# Altium schematic sheet STM32Fx.SchDoc
size A4; DocumentNumber: 3; Revision: C.1(PCB.SCH); SheetNumber: 3; SheetTotal: 4
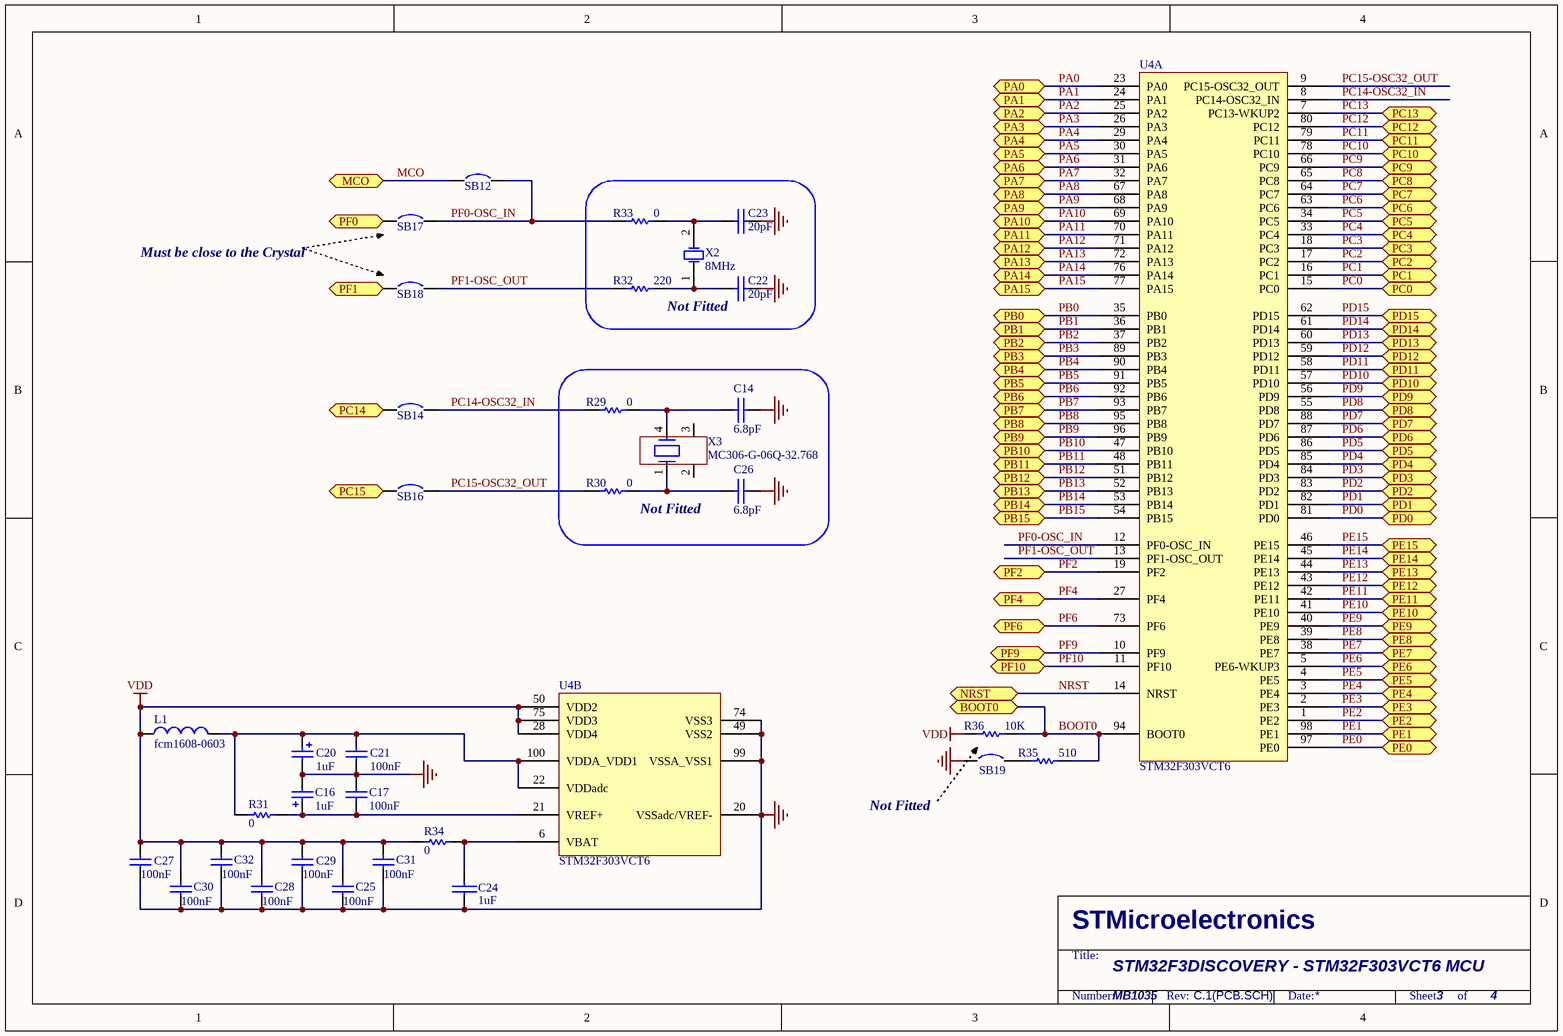
[diagram p0: STM32Fx.SchDoc]

## Parts
C14  6.8pF  [0603C]
C16  1uF  [CASE-AA]
C17  100nF  [0603C]
C20  1uF  [CASE-AA]
C21  100nF  [0603C]
C22  20pF  [0603C]
C23  20pF  [0603C]
C24  1uF  [0603C]
C25  100nF  [0603C]
C26  6.8pF  [0603C]
C27  100nF  [0603C]
C28  100nF  [0603C]
C29  100nF  [0603C]
C30  100nF  [0603C]
C31  100nF  [0603C]
C32  100nF  [0603C]
L1  fcm1608-0603  [0603L]
R29  0  [0402R]
R30  0  [0402R]
R31  0  [0402R]
R32  220  [0402R]
R33  0  [0402R]
R34  0  [0402R]
R35  510  [0402R]
R36  10K  [0402R]
SB12  Circuit Breaker  [JP2_SMD]  (value not drawn)
SB14  Circuit Breaker  [JP2_SMD]  (value not drawn)
SB16  Circuit Breaker  [JP2_SMD]  (value not drawn)
SB17  Circuit Breaker  [JP2_SMD]  (value not drawn)
SB18  Circuit Breaker  [JP2_SMD]  (value not drawn)
SB19  Circuit Breaker  [JP2_SMD]  (value not drawn)
U4  STM32F303VCT6  [LQFP100]  (parts A,B of 2)
X2  8MHz  [XTAL1]
X3  MC306-G-06Q-32.768  [MC306-CRYSTAL]

## Blocks framed on the sheet
Not Fitted: C22 C23 R32 R33 X2
Not Fitted: C14 C26 R29 R30 X3

## Ports
BOOT0, MCO, NRST, PA0, PA1, PA2, PA3, PA4, PA5, PA6, PA7, PA8, PA9, PA10, PA11, PA12, PA13, PA14, PA15, PB0, PB1, PB2, PB3, PB4, PB5, PB6, PB7, PB8, PB9, PB10, PB11, PB12, PB13, PB14, PB15, PC0, PC1, PC2, PC3, PC4, PC5, PC6, PC7, PC8, PC9, PC10, PC11, PC12, PC13, PC14, PC15, PD0, PD1, PD2, PD3, PD4, PD5, PD6, PD7, PD8, PD9, PD10, PD11, PD12, PD13, PD14, PD15, PE0, PE1, PE2, PE3, PE4, PE5, PE6, PE7, PE8, PE9, PE10, PE11, PE12, PE13, PE14, PE15, PF0, PF1, PF2, PF4, PF6, PF9, PF10

## Nets
GND: C14.2 C16.2 C17.1 C20.2 C21.1 C22.1 C23.1 C24.2 C25.1 C26.2 C27.1 C28.1 C29.1 C30.1 C31.2 C32.2 SB19.1 U4.20(VSSadc/VREF-) U4.49(VSS2) U4.74(VSS3) U4.99(VSSA_VSS1)
VDD: C25.2 C27.2 C28.2 C29.2 C30.2 C31.1 C32.1 L1.1 R34.2 R36.1 U4.28(VDD4) U4.50(VDD2) U4.75(VDD3)
BOOT0: R35.2 R36.2 U4.94(BOOT0) ; port BOOT0
MCO: SB12.1 ; port MCO
NRST: U4.14(NRST) ; port NRST
PA0: U4.23(PA0) ; port PA0
PA1: U4.24(PA1) ; port PA1
PA2: U4.25(PA2) ; port PA2
PA3: U4.26(PA3) ; port PA3
PA4: U4.29(PA4) ; port PA4
PA5: U4.30(PA5) ; port PA5
PA6: U4.31(PA6) ; port PA6
PA7: U4.32(PA7) ; port PA7
PA8: U4.67(PA8) ; port PA8
PA9: U4.68(PA9) ; port PA9
PA10: U4.69(PA10) ; port PA10
PA11: U4.70(PA11) ; port PA11
PA12: U4.71(PA12) ; port PA12
PA13: U4.72(PA13) ; port PA13
PA14: U4.76(PA14) ; port PA14
PA15: U4.77(PA15) ; port PA15
PB0: U4.35(PB0) ; port PB0
PB1: U4.36(PB1) ; port PB1
PB2: U4.37(PB2) ; port PB2
PB3: U4.89(PB3) ; port PB3
PB4: U4.90(PB4) ; port PB4
PB5: U4.91(PB5) ; port PB5
PB6: U4.92(PB6) ; port PB6
PB7: U4.93(PB7) ; port PB7
PB8: U4.95(PB8) ; port PB8
PB9: U4.96(PB9) ; port PB9
PB10: U4.47(PB10) ; port PB10
PB11: U4.48(PB11) ; port PB11
PB12: U4.51(PB12) ; port PB12
PB13: U4.52(PB13) ; port PB13
PB14: U4.53(PB14) ; port PB14
PB15: U4.54(PB15) ; port PB15
PC0: U4.15(PC0) ; port PC0
PC1: U4.16(PC1) ; port PC1
PC2: U4.17(PC2) ; port PC2
PC3: U4.18(PC3) ; port PC3
PC4: U4.33(PC4) ; port PC4
PC5: U4.34(PC5) ; port PC5
PC6: U4.63(PC6) ; port PC6
PC7: U4.64(PC7) ; port PC7
PC8: U4.65(PC8) ; port PC8
PC9: U4.66(PC9) ; port PC9
PC10: U4.78(PC10) ; port PC10
PC11: U4.79(PC11) ; port PC11
PC12: U4.80(PC12) ; port PC12
PC13: U4.7(PC13-WKUP2) ; port PC13
PC14: SB14.1 ; port PC14
PC14-OSC32_IN: R29.1 SB14.2 U4.8(PC14-OSC32_IN)
PC15: SB16.1 ; port PC15
PC15-OSC32_OUT: R30.1 SB16.2 U4.9(PC15-OSC32_OUT)
PD0: U4.81(PD0) ; port PD0
PD1: U4.82(PD1) ; port PD1
PD2: U4.83(PD2) ; port PD2
PD3: U4.84(PD3) ; port PD3
PD4: U4.85(PD4) ; port PD4
PD5: U4.86(PD5) ; port PD5
PD6: U4.87(PD6) ; port PD6
PD7: U4.88(PD7) ; port PD7
PD8: U4.55(PD8) ; port PD8
PD9: U4.56(PD9) ; port PD9
PD10: U4.57(PD10) ; port PD10
PD11: U4.58(PD11) ; port PD11
PD12: U4.59(PD12) ; port PD12
PD13: U4.60(PD13) ; port PD13
PD14: U4.61(PD14) ; port PD14
PD15: U4.62(PD15) ; port PD15
PE0: U4.97(PE0) ; port PE0
PE1: U4.98(PE1) ; port PE1
PE2: U4.1(PE2) ; port PE2
PE3: U4.2(PE3) ; port PE3
PE4: U4.3(PE4) ; port PE4
PE5: U4.4(PE5) ; port PE5
PE6: U4.5(PE6-WKUP3) ; port PE6
PE7: U4.38(PE7) ; port PE7
PE8: U4.39(PE8) ; port PE8
PE9: U4.40(PE9) ; port PE9
PE10: U4.41(PE10) ; port PE10
PE11: U4.42(PE11) ; port PE11
PE12: U4.43(PE12) ; port PE12
PE13: U4.44(PE13) ; port PE13
PE14: U4.45(PE14) ; port PE14
PE15: U4.46(PE15) ; port PE15
PF0: SB17.1 ; port PF0
PF0-OSC_IN: R33.1 SB12.2 SB17.2 U4.12(PF0-OSC_IN)
PF1: SB18.1 ; port PF1
PF1-OSC_OUT: R32.1 SB18.2 U4.13(PF1-OSC_OUT)
PF2: U4.19(PF2) ; port PF2
PF4: U4.27(PF4) ; port PF4
PF6: U4.73(PF6) ; port PF6
PF9: U4.10(PF9) ; port PF9
PF10: U4.11(PF10) ; port PF10
NetC14_1: C14.1 R29.2 X3.4
NetC16_1: C16.1 C17.2 R31.1 U4.21(VREF+)
NetC20_1: C20.1 C21.2 L1.2 R31.2 U4.22(VDDadc) U4.100(VDDA_VDD1)
NetC22_2: C22.2 R32.2 X2.1(OSC1)
NetC23_2: C23.2 R33.2 X2.2(OSC2)
NetC24_1: C24.1 R34.1 U4.6(VBAT)
NetC26_1: C26.1 R30.2 X3.1
NetR35_1: R35.1 SB19.2

Not connected (* = marked no-connect by the designer): X3 2 3

## Notes on the sheet
- Must be close to the Crystal
- Not Fitted
- STM32F3DISCOVERY - STM32F303VCT6 MCU
- MB1035
- STMicroelectronics
- Title:
- Number:
- Rev:
- Date:
- Sheet       of

## Library data of the parts
C14 C22 C23 C26 = CAP: Capacitor; Fitted: NO
  C14 C26: Value: 6.8pF
  C22 C23: Value: 20pF
C16 C20 = Cap Pol1: Polarized Capacitor (Radial); Value: 10uF; Published: 8-Jun-2000; Revision: July-2002: Re-released for DXP Platform.; Publisher: Altium Limited
C17 C21 C25 C27-C32 = Cap: Capacitor; Published: 8-Jun-2000; Revision: July-2002: Re-released for DXP Platform.; Publisher: Altium Limited; Value: 100nF
C24 = CAP: Capacitor; Value: 1uF
L1 = Inductor: Value: 100uH; Published: 8-Jun-2000; Revision: July-2002: Re-released for DXP Platform.; Publisher: Altium Limited
R29 R30 R32 R33 = res1: Resistor; Value: 1K5; Fitted: NO; Published: 8-Jun-2000; Revision: July-2002: Re-released for DXP Platform.; Publisher: Altium Limited
R31 R34 = Res1: Resistor; Value: 1K; Published: 8-Jun-2000; Revision: July-2002: Re-released for DXP Platform.; Publisher: Altium Limited
R35 = res1: Resistor; Value: 10K; Published: 8-Jun-2000; Revision: July-2002: Re-released for DXP Platform.; Publisher: Altium Limited
R36 = res1: Resistor; Fitted: NO; Published: 8-Jun-2000; Revision: July-2002: Re-released for DXP Platform.; Publisher: Altium Limited; Value: 10K
SB12 SB14 SB16 SB18 SB19 = Circuit Breaker: Solder: YES; Published: 24-Mar-1999; Revision: July-2002: Re-released for DXP Platform.; Publisher: Altium Limited
SB17 = Circuit Breaker: Solder: NO; Published: 24-Mar-1999; Revision: July-2002: Re-released for DXP Platform.; Publisher: Altium Limited
U4 = STM32F303VCT6: STM32F303VCT6 (Manta-Edge); Manuf_1: STM; Provided: ST; Order: STM32F303VCT6; Manuf_Part_1: STM32F303VCT6; Distrib: ST
X2 = XTAL: Crystal Oscillator; Fitted: NO; Published: 8-Jun-2000; LatestRevisionDate: 17-Jul-2002; LatestRevisionNote: Re-released for DXP Platform.; PackageReference: R38; Publisher: Altium Limited
X3 = MC306: Fitted: NO